# EAGLE schematic BatteryBuzzerTest (EAGLE 8.0.0)
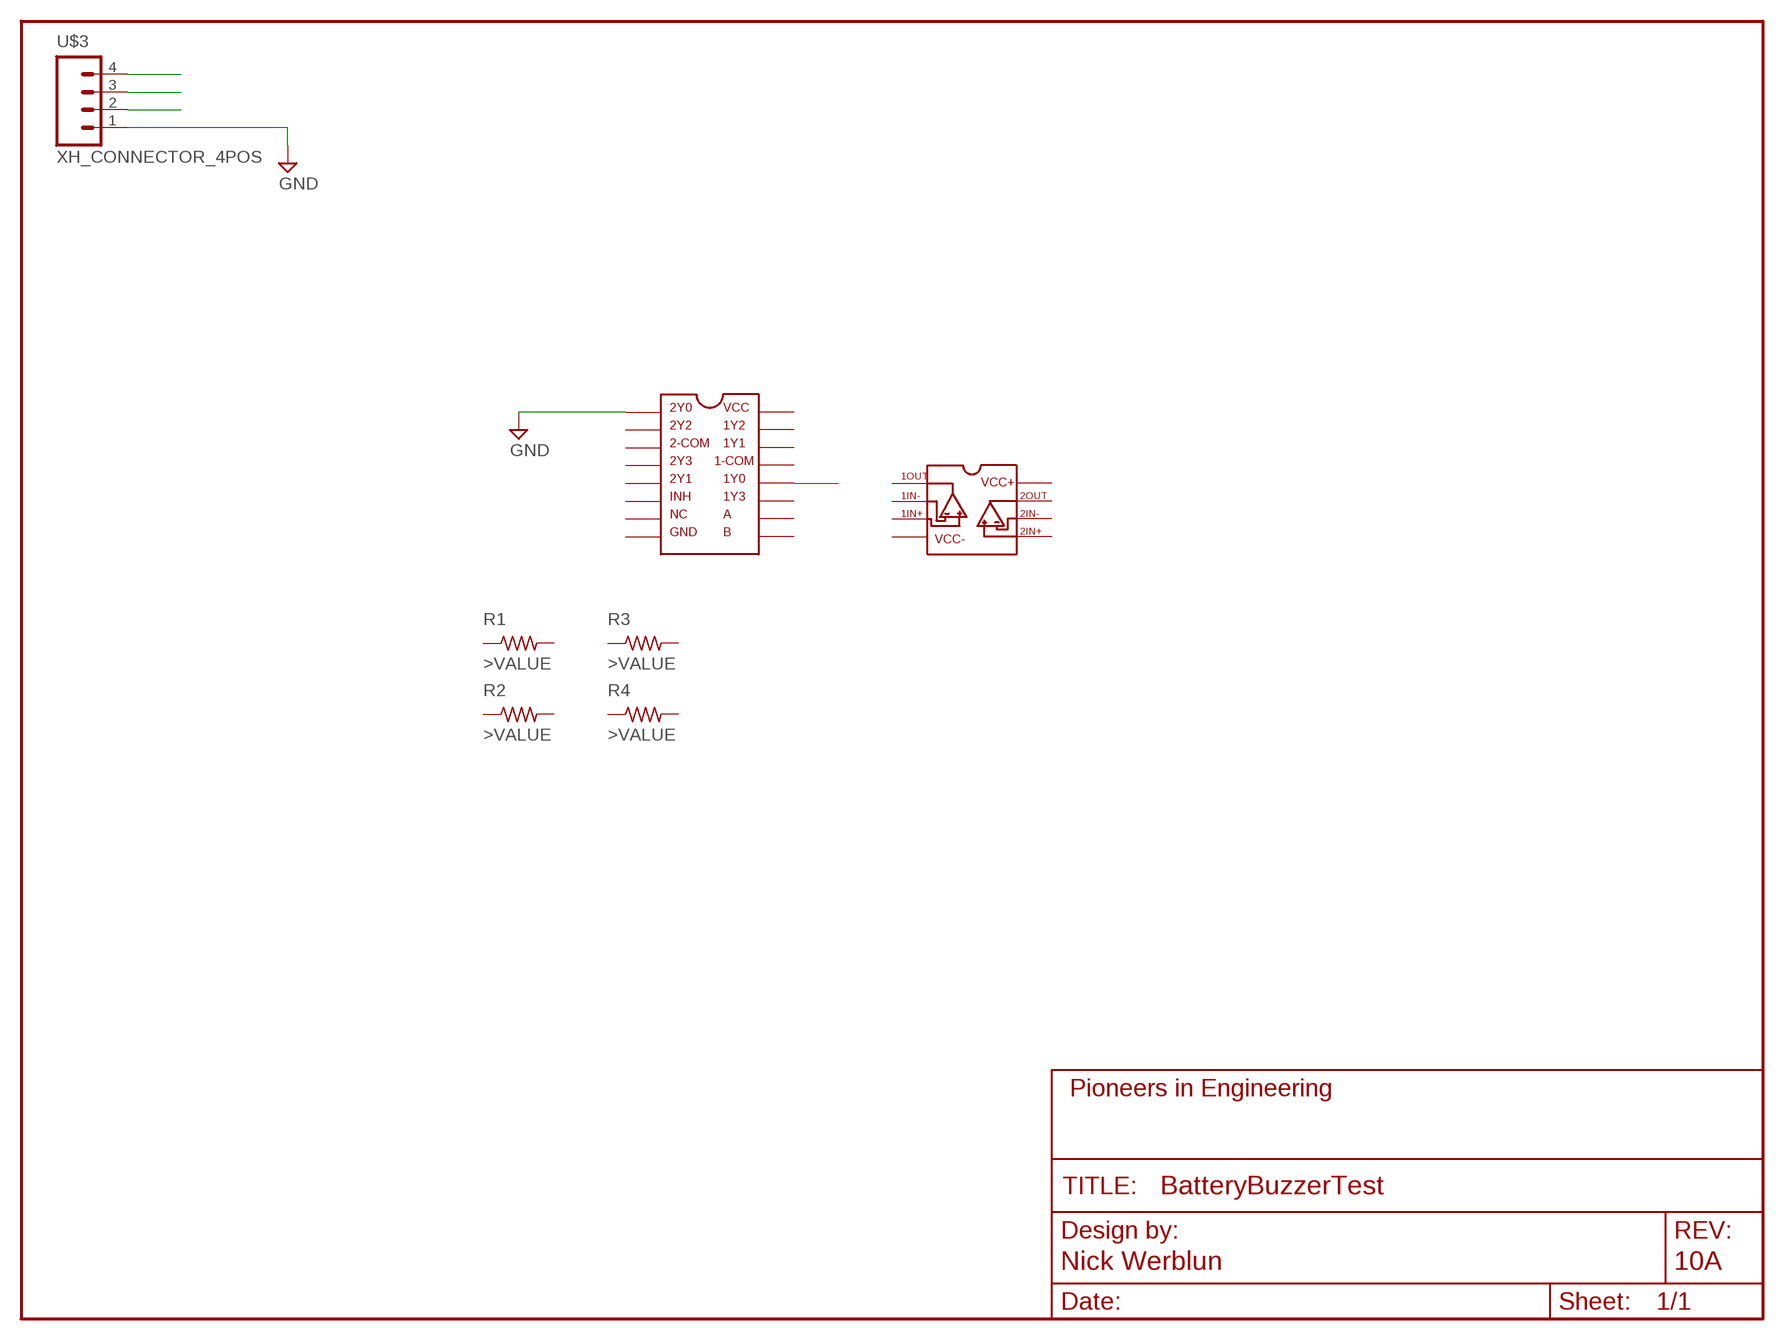
[diagram p0: schematic, sheet 1]
FRAME1 (FRAME_SCHEMATIC): AUTHOR: Nick Werblun; REVISION: 10A; TITLE: Battery Buzzer Test

## Parts
R1  >VALUE  R-US_R0603  [R0603]
R2  >VALUE  R-US_R0603  [R0603]
R3  >VALUE  R-US_R0603  [R0603]
R4  >VALUE  R-US_R0603  [R0603]
U$1  SN74HC4852  [DIL16]
U$2  TL072  [DIL08]
U$3  XH_CONNECTOR_4POS  [XH_CONNECTOR_4POS_2.5MM]

## Nets
BCELL1: U$1.12(1Y0) U$3.2
BCELL2: U$3.3
BCELL3: U$3.4
GND: U$1.1(2Y0) U$3.1
Unconnected: R1.1 R1.2 R2.1 R2.2 R3.1 R3.2 R4.1 R4.2 U$1.2(2Y2) U$1.3(2-COM) U$1.4(2Y3) U$1.5(2Y1) U$1.6(INH) U$1.7(NC) U$1.8(GND) U$1.9(B) U$1.10(A) U$1.11(1Y3) U$1.13(1-COM) U$1.14(1Y1) U$1.15(1Y2) U$1.16(VCC) U$2.1(1OUT) U$2.2(1IN-) U$2.3(1IN+) U$2.4(VCC-) U$2.5(2IN+) U$2.6(2IN-) U$2.7(2OUT) U$2.8(VCC+)

## Library data of the parts
R1-R4 = pie:R-US_: RESISTOR, American symbol; DESCRIPTION: RESISTOR, American symbol; DISTRIBUTOR: DigiKey; MANUFACTURER: Rohm Semiconductor; NOTES: Cut Tape; PACKAGE: R0603
U$1 = pie:SN74HC4852
U$2 = pie:TL072
U$3 = pie:XH_CONNECTOR_4POS: 4-pin XH connector (through-hole type shrouded header); PIE-INT-REF-NUM: XH-4POS; PIE_DIGIKEY-PN: 455-2249-ND